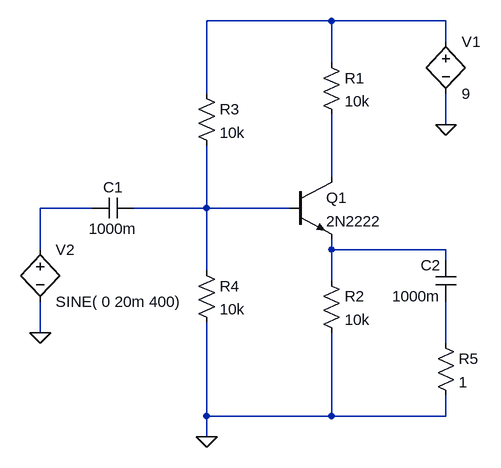
[diagram p0: schematic Primer3.asc]
Primer3.asc, the LTspice schematic file:
Version 4
SHEET 1 880 680
WIRE 368 -192 176 -192
WIRE 544 -192 368 -192
WIRE 544 -160 544 -192
WIRE 368 -128 368 -192
WIRE 176 -80 176 -192
WIRE 544 -32 544 -80
WIRE 368 48 368 -48
WIRE 0 96 -80 96
WIRE 176 96 176 0
WIRE 176 96 64 96
WIRE 304 96 176 96
WIRE -80 160 -80 96
WIRE 368 160 368 144
WIRE 544 160 368 160
WIRE 544 176 544 160
WIRE 176 192 176 96
WIRE 368 208 368 160
WIRE -80 288 -80 240
WIRE 544 304 544 240
WIRE 176 416 176 272
WIRE 368 416 368 288
WIRE 368 416 176 416
WIRE 544 416 544 384
WIRE 544 416 368 416
WIRE 176 448 176 416
FLAG -80 288 0
FLAG 544 -32 0
FLAG 176 448 0
SYMBOL res 352 -144 R0
SYMATTR InstName R1
SYMATTR Value 10k
SYMBOL res 352 192 R0
SYMATTR InstName R2
SYMATTR Value 10k
SYMBOL res 160 -96 R0
SYMATTR InstName R3
SYMATTR Value 10k
SYMBOL res 160 176 R0
SYMATTR InstName R4
SYMATTR Value 10k
SYMBOL res 528 288 R0
SYMATTR InstName R5
SYMATTR Value 1
SYMBOL cap 64 80 R90
WINDOW 0 0 32 VBottom 2
WINDOW 3 32 32 VTop 2
SYMATTR InstName C1
SYMATTR Value 1000m
SYMBOL cap 560 240 R180
WINDOW 0 24 56 Left 2
WINDOW 3 24 8 Left 2
SYMATTR InstName C2
SYMATTR Value 1000m
SYMBOL npn 304 48 R0
SYMATTR InstName Q1
SYMATTR Value 2N2222
SYMBOL bv -80 144 R0
SYMATTR InstName V2
SYMATTR Value SINE( 0 20m 400)
SYMBOL bv 544 -176 R0
SYMATTR InstName V1
SYMATTR Value 9

The netlist it stands for:
* Primer3.asc
R1 N001 N002 10k
R2 N005 0 10k
R3 N001 N004 10k
R4 N004 0 10k
R5 N006 0 1
C1 N004 N003 1000m
C2 N006 N005 1000m
Q1 N002 N004 N005 0 2N2222
B§V2 N003 0 SINE( 0 20m 400)
B§V1 N001 0 9
.model NPN NPN
.model PNP PNP
.lib standard.bjt
.backanno
.end